# Altium schematic sheet 1_P1.schdoc
size 429 x 307 mm; Symbol: Drawing-Symbol_A4; Device: Drawing-Symbol_A4; @Project Name: control; @Page Count: 1; @Update Date: 2025-11-05; @Create Date: 2025-10-25; @Schematic Name: Schematic1; @Page No: 1; @Page Name: P1; Company: EasyEDA.com; Version: V1.0; Page Size: A4; @Create Time: 06:52:06; @Update Time: 14:48:32; Width: 1655; Height: 1170; Region Start: 1; X Region Count: 6; Y Region Count: 4; Blade Width: 10; Title Block Position: 3; @Board Name: Board1
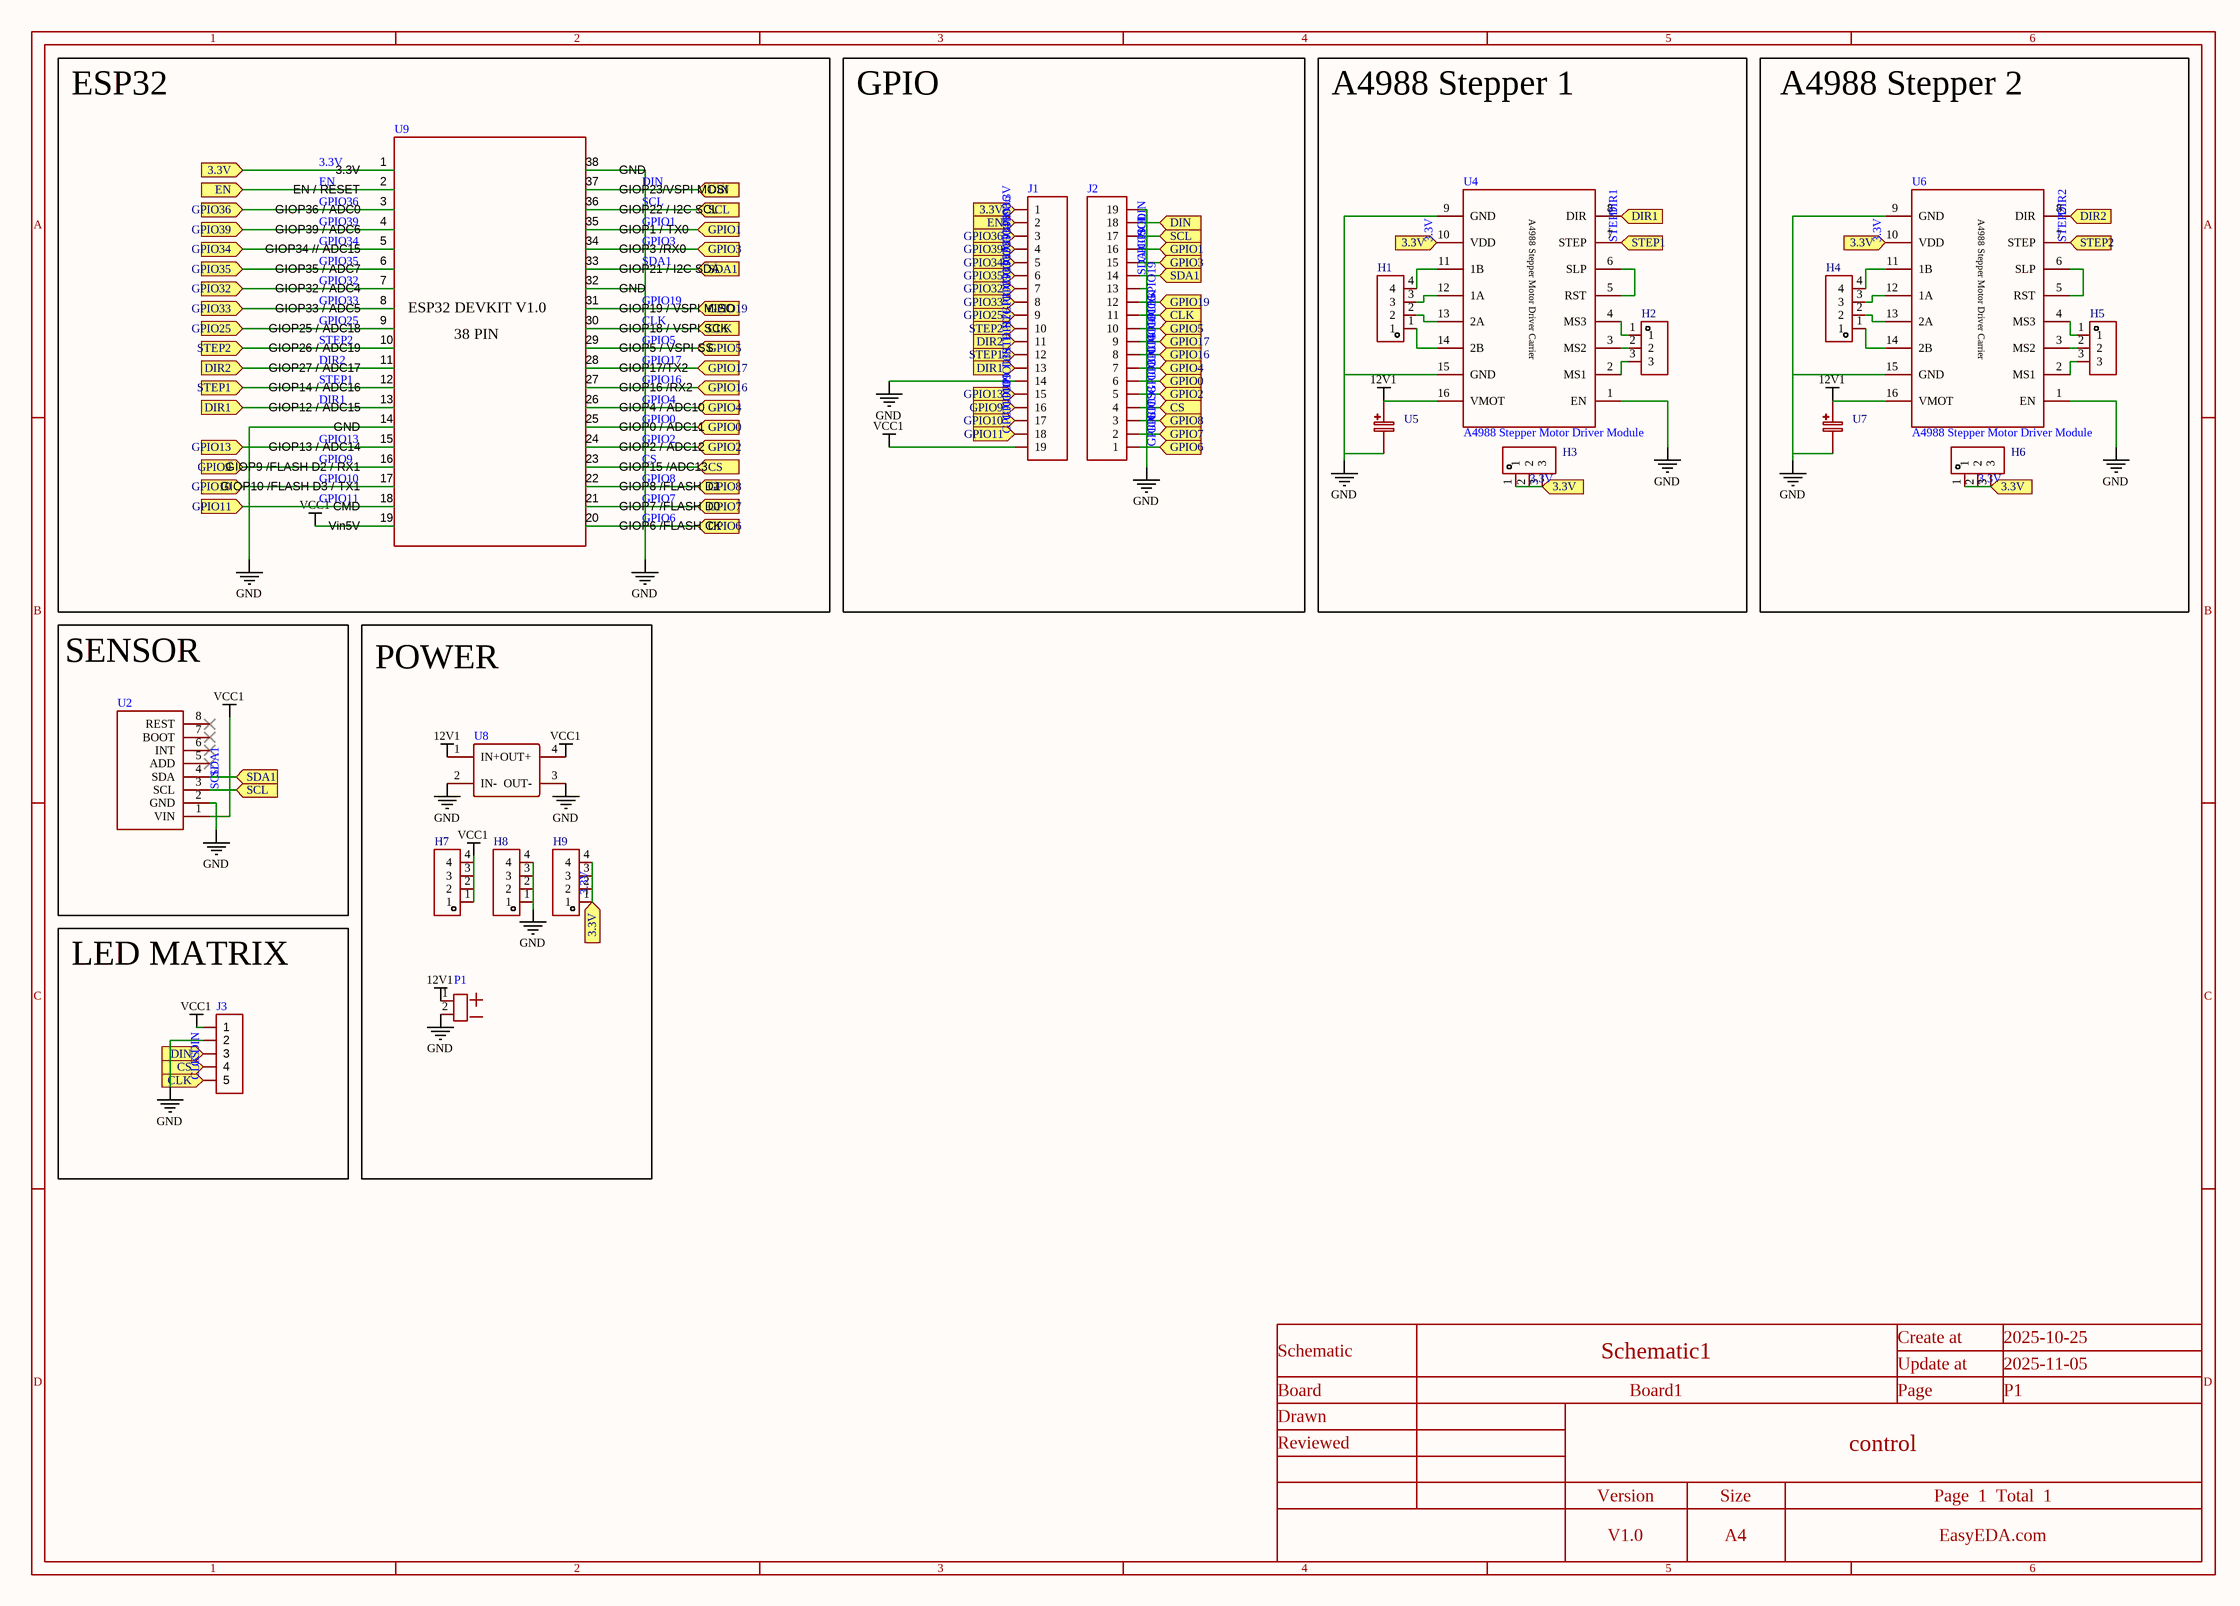
[diagram p0: 1_P1.schdoc]

## Parts
H1  HX PH254-01-04-Z-L11.5 straight pin header  [HDR-TH_4P-HX-PH254-01-04-Z-L11.5]  (value not drawn)
H2  HX PH254-01-03-Z-L11.5 pcb pin header  [HDR-TH_3P-P2.54-V-M-1]  (value not drawn)
H3  HX PH254-01-03-Z-L11.5 pcb pin header  [HDR-TH_3P-P2.54-V-M-1]  (value not drawn)
H4  HX PH254-01-04-Z-L11.5 straight pin header  [HDR-TH_4P-HX-PH254-01-04-Z-L11.5]  (value not drawn)
H5  HX PH254-01-03-Z-L11.5 pcb pin header  [HDR-TH_3P-P2.54-V-M-1]  (value not drawn)
H6  HX PH254-01-03-Z-L11.5 pcb pin header  [HDR-TH_3P-P2.54-V-M-1]  (value not drawn)
H7  HX PH254-01-04-Z-L11.5 straight pin header  [HDR-TH_4P-HX-PH254-01-04-Z-L11.5]  (value not drawn)
H8  HX PH254-01-04-Z-L11.5 straight pin header  [HDR-TH_4P-HX-PH254-01-04-Z-L11.5]  (value not drawn)
H9  HX PH254-01-04-Z-L11.5 straight pin header  [HDR-TH_4P-HX-PH254-01-04-Z-L11.5]  (value not drawn)
J1  2.54mm 1x22 Pin Header DIP  [IDC-1X20]  (value not drawn)
J2  2.54mm 1x22 Pin Header DIP  [IDC-1X20]  (value not drawn)
J3  KK254_PCB-header_right-angle_5Pin  [KK254_PCB-HEADER_RIGHT-ANGLE_5PIN]  (value not drawn)
P1  2 pin pluggable terminal block socket  [TERMINAL_PLUGGABLE_MALE_1X2_3.5MM]  (value not drawn)
U2  (no value)  [BNO055]
U4  A4988 Stepper Motor Driver Module  [POLOLU_BREAKOUT-16_15.2X20.3MM_HARIS_1]
U5  B35281411  [ELECTROLYTIC_CAPACITOR_5X11]  (value not drawn)
U6  A4988 Stepper Motor Driver Module  [POLOLU_BREAKOUT-16_15.2X20.3MM_HARIS_1]
U7  B35281411  [ELECTROLYTIC_CAPACITOR_5X11]  (value not drawn)
U8  (no value)  [LM2596 DC-DC adjustable step-down]
U9  (no value)  [ESP32 NODEMCU 38 PINS FOOTPRINT]

## Blocks framed on the sheet
ESP32: U9
GPIO: J1 J2
A4988 Stepper 1: H1-H3 U4 U5
A4988 Stepper 2: H4-H6 U6 U7
SENSOR: U2
POWER: H7-H9 P1 U8
LED MATRIX: J3

## Ports
3.3V (in), CLK (in), CS (in), DIN (in), DIR1 (in), DIR2 (in), EN (in), GPIO0 (in), GPIO1 (in), GPIO2 (in), GPIO3 (in), GPIO4 (in), GPIO5 (in), GPIO6 (in), GPIO7 (in), GPIO8 (in), GPIO9 (in), GPIO10 (in), GPIO11 (in), GPIO13 (in), GPIO16 (in), GPIO17 (in), GPIO19 (in), GPIO25 (in), GPIO32 (in), GPIO33 (in), GPIO34 (in), GPIO35 (in), GPIO36 (in), GPIO39 (in), SCL (in), SDA1 (in), STEP1 (in), STEP2 (in)

## Nets
12V1: P1.1 U4.16(VMOT) U5.1 U6.16(VMOT) U7.1 U8.1(IN+)
GND: H8.1 H8.2 H8.3 H8.4 J1.14 J2.13 J2.19 J3.2 P1.2 U2.2(GND) U4.1(EN) U4.9(GND) U4.15(GND) U5.2 U6.1(EN) U6.9(GND) U6.15(GND) U7.2 U8.2(IN-) U8.3(OUT-) U9.14(GND) U9.32(GND) U9.38(GND)
VCC1: H7.1 H7.2 H7.3 H7.4 J1.19 J3.1 U2.1(VIN) U8.4(OUT+) U9.19(Vin5V)
3.3V: H3.1 H3.2 H3.3 H6.1 H6.2 H6.3 H9.1 H9.2 H9.3 H9.4 J1.1 U4.10(VDD) U6.10(VDD) U9.1(3.3V) ; port 3.3V
CLK: J2.11 J3.5 U9.30(GIOP18_/_VSPI_SCK) ; port CLK
CS: J2.4 J3.4 U9.23(GIOP15_/ADC13) ; port CS
DIN: J2.18 J3.3 U9.37(GIOP23/VSPI_MOSI) ; port DIN
DIR1: J1.13 U4.8(DIR) U9.13(GIOP12_/_ADC15) ; port DIR1
DIR2: J1.11 U6.8(DIR) U9.11(GIOP27_/_ADC17) ; port DIR2
EN: J1.2 U9.2(EN_/_RESET) ; port EN
GPIO0: J2.6 U9.25(GIOP0_/_ADC11) ; port GPIO0
GPIO1: J2.16 U9.35(GIOP1_/_TX0) ; port GPIO1
GPIO2: J2.5 U9.24(GIOP2_/_ADC12) ; port GPIO2
GPIO3: J2.15 U9.34(GIOP3_/RX0) ; port GPIO3
GPIO4: J2.7 U9.26(GIOP4_/_ADC10) ; port GPIO4
GPIO5: J2.10 U9.29(GIOP5_/_VSPI_SS) ; port GPIO5
GPIO6: J2.1 U9.20(GIOP6_/FLASH_CK) ; port GPIO6
GPIO7: J2.2 U9.21(GIOP7_/FLASH_D0) ; port GPIO7
GPIO8: J2.3 U9.22(GIOP8_/FLASH_D1) ; port GPIO8
GPIO9: J1.16 U9.16(GIOP9_/FLASH_D2_/_RX1) ; port GPIO9
GPIO10: J1.17 U9.17(GIOP10_/FLASH_D3_/_TX1) ; port GPIO10
GPIO11: J1.18 U9.18(CMD) ; port GPIO11
GPIO13: J1.15 U9.15(GIOP13_/_ADC14) ; port GPIO13
GPIO16: J2.8 U9.27(GIOP16_/RX2) ; port GPIO16
GPIO17: J2.9 U9.28(GIOP17/TX2) ; port GPIO17
GPIO19: J2.12 U9.31(GIOP19_/_VSPI_MISO) ; port GPIO19
GPIO25: J1.9 U9.9(GIOP25_/_ADC18) ; port GPIO25
GPIO32: J1.7 U9.7(GIOP32_/_ADC4) ; port GPIO32
GPIO33: J1.8 U9.8(GIOP33_/_ADC5) ; port GPIO33
GPIO34: J1.5 U9.5(GIOP34_//_ADC15) ; port GPIO34
GPIO35: J1.6 U9.6(GIOP35_/_ADC7) ; port GPIO35
GPIO36: J1.3 U9.3(GIOP36_/_ADC0) ; port GPIO36
GPIO39: J1.4 U9.4(GIOP39_/_ADC6) ; port GPIO39
SCL: J2.17 U2.3(SCL) U9.36(GIOP22_/_I2C_SCL) ; port SCL
SDA1: J2.14 U2.4(SDA) U9.33(GIOP21_/_I2C_SDA) ; port SDA1
STEP1: J1.12 U4.7(STEP) U9.12(GIOP14_/_ADC16) ; port STEP1
STEP2: J1.10 U6.7(STEP) U9.10(GIOP26_/_ADC19) ; port STEP2
NetH1_1: H1.1 U4.14(2B)
NetH1_2: H1.2 U4.13(2A)
NetH1_3: H1.3 U4.12(1A)
NetH1_4: H1.4 U4.11(1B)
NetH2_1: H2.1 U4.4(MS3)
NetH2_2: H2.2 U4.3(MS2)
NetH2_3: H2.3 U4.2(MS1)
NetH4_1: H4.1 U6.14(2B)
NetH4_2: H4.2 U6.13(2A)
NetH4_3: H4.3 U6.12(1A)
NetH4_4: H4.4 U6.11(1B)
NetH5_1: H5.1 U6.4(MS3)
NetH5_2: H5.2 U6.3(MS2)
NetH5_3: H5.3 U6.2(MS1)
NetU4_5: U4.5(RST) U4.6(SLP)
NetU6_5: U6.5(RST) U6.6(SLP)

Not connected (* = marked no-connect by the designer): U2 5(ADD)* 6(INT)* 7(BOOT)* 8(REST)*

## Notes on the sheet
- 1
- 2
- 3
- 4
- 5
- 6
- A
- B
- C
- Schematic
- Schematic1
- Create at
- Update at
- 2025-10-25
- 2025-11-05
- D
- Board
- Drawn
- Board1
- Page
- P1
- Reviewed
- Version
- Size
- control
- Page  1  Total  1
- V1.0
- A4
- EasyEDA.com
- (in symbol A4988 Stepper Motor Driver Module2) A4988 Stepper Motor Driver Carrier
- (in symbol ESP32-DEVKITV1-38PIN) ESP32 DEVKIT V1.0; 38 PIN

## Library data of the parts
H1 H4 H7-H9 = HX PH254-01-04-Z-L11.5 straight pin header: Manufacturer: hanxia(韩下); Add into BOM: yes; Pin Structure: 1x4P; Pitch: 2.54mm; Current Rating: 3A; Voltage Rating (Max): 1kV; Symbol: HX PH254-01-04-Z-L11.5 STRAIGHT PIN HEADER; Device: HX PH254-01-04-Z-L11.5 straight pin header; LCSC Part Name: 1x4P 间距:2.54mm 方针 直插; Supplier Part: C52016392; Manufacturer Part: HX PH254-01-04-Z-L11.5 straight pin header; Supplier Footprint: 插件,P=2.54mm; JLCPCB Part Class: Extended Part; Datasheet: https://item.szlcsc.com/datasheet/HX%2520PH254-01-04-Z-L11.5%2520straight%2520pin%2520header/54760437.html; Supplier: LCSC; Convert to PCB: yes; Circluar Pins/Square Pins: Pin Header; Mounting Type: Through Hole; Number of Rows: 1; Number of Pins: 4P; Length of Mating Pin: 6mm; Insulation Height: 2.5mm; Length of End Connection Pin: 3mm; Contact Material: Brass; Contact Plating: Gold; Operating Temperature: -40℃~+105℃
H2 H3 H5 H6 = HX PH254-01-03-Z-L11.5 pcb pin header: Manufacturer: hanxia(韩下); Add into BOM: yes; Pin Structure: 1x3P; Pitch: 2.54mm; Current Rating: 3A; Voltage Rating (Max): 1kV; Symbol: HX PH254-01-03-Z-L11.5 PCB PIN HEADER; Device: HX PH254-01-03-Z-L11.5 pcb pin header; LCSC Part Name: 1x3P 间距:2.54mm 方针 直插; Supplier Part: C52016391; Manufacturer Part: HX PH254-01-03-Z-L11.5 pcb pin header; Supplier Footprint: 插件,P=2.54mm; JLCPCB Part Class: Extended Part; Datasheet: https://item.szlcsc.com/datasheet/HX%2520PH254-01-03-Z-L11.5%2520pcb%2520pin%2520header/54760436.html; Supplier: LCSC; Convert to PCB: yes; Circluar Pins/Square Pins: Pin Header; Mounting Type: Through Hole; Number of Rows: 1; Number of Pins: 3P; Length of Mating Pin: 6mm; Insulation Height: 2.5mm; Length of End Connection Pin: 3mm; Contact Material: Brass; Contact Plating: Gold; Operating Temperature: -40℃~+105℃
J1 J2 = 2.54mm 1x22 Pin Header DIP: Add into BOM: yes; Symbol: 2.54mm 1x22 Pin Header DIP; Device: 2.54mm 1x22 Pin Header DIP; Convert to PCB: yes
J3 = KK254_PCB-header_right-angle_5Pin: Manufacturer Part: molex; Add into BOM: yes; Symbol: KK254_PCB-header_right-angle_5Pin; Device: KK254_PCB-header_right-angle_5Pin; Convert to PCB: yes; 3DModel: KK254_PCB-HEADER_RIGHT-ANGLE_5PIN; Supplier Part: 22124052; Supplier: Distrelec; link: https://www.molex.com/molex/products/part-detail/pcb_headers/0022124052
P1 = 2 pin pluggable terminal block socket: Manufacturer Part: OQ0212510000G; Manufacturer: Anytek; Convert to PCB: yes; Symbol: 2 pin pluggable terminal block socket; Device: 2 pin pluggable terminal block socket; Supplier Part: OQ0212510000G; Link: http://www.anytek.com.cn/en/detail/142/5706.html; Supplier: LCSC/ Seeed; Mounted: Yes; Add into BOM: yes
U2 = GY-BNO055: Add into BOM: yes; Symbol: GY-BNO055; Device: GY-BNO055; Convert to PCB: yes
U4 U6 = A4988 Stepper Motor Driver Module2: Add into BOM: no; Convert to PCB: yes; Symbol: A4988 Stepper Motor Driver Module2; Device: A4988 Stepper Motor Driver Module2
U5 U7 = B35281411: Add into BOM: yes; Symbol: B35281411; Device: B35281411; LCSC Part Name: B35281411; Supplier Part: C9900008861; Manufacturer Part: B35281411; Supplier Footprint: 10uF/25V; JLCPCB Part Class: Extended Part; Supplier: LCSC; Convert to PCB: yes
U8 = LM2596 DC-DC adjustable step-down: Add into BOM: yes; Symbol: LM2596 DC-DC adjustable step-down; Device: LM2596 DC-DC adjustable step-down; Convert to PCB: yes
U9 = ESP32-DEVKITV1-38PIN: Manufacturer: espressif; Manufacturer Part: ESP-WROOM-32; Add into BOM: yes; Symbol: ESP32-DEVKITV1-38PIN; Device: ESP32-DEVKITV1-38PIN; Supplier: Aliexpress; link: https://docs.espressif.com/projects/esp-idf/en/latest/esp32/hw-reference/esp32/get-started-devkitc.html; Convert to PCB: yes